# EasyEDA Pro project ProPrj_102-HQU15集成板_Vel1.0.epro, board PCB1
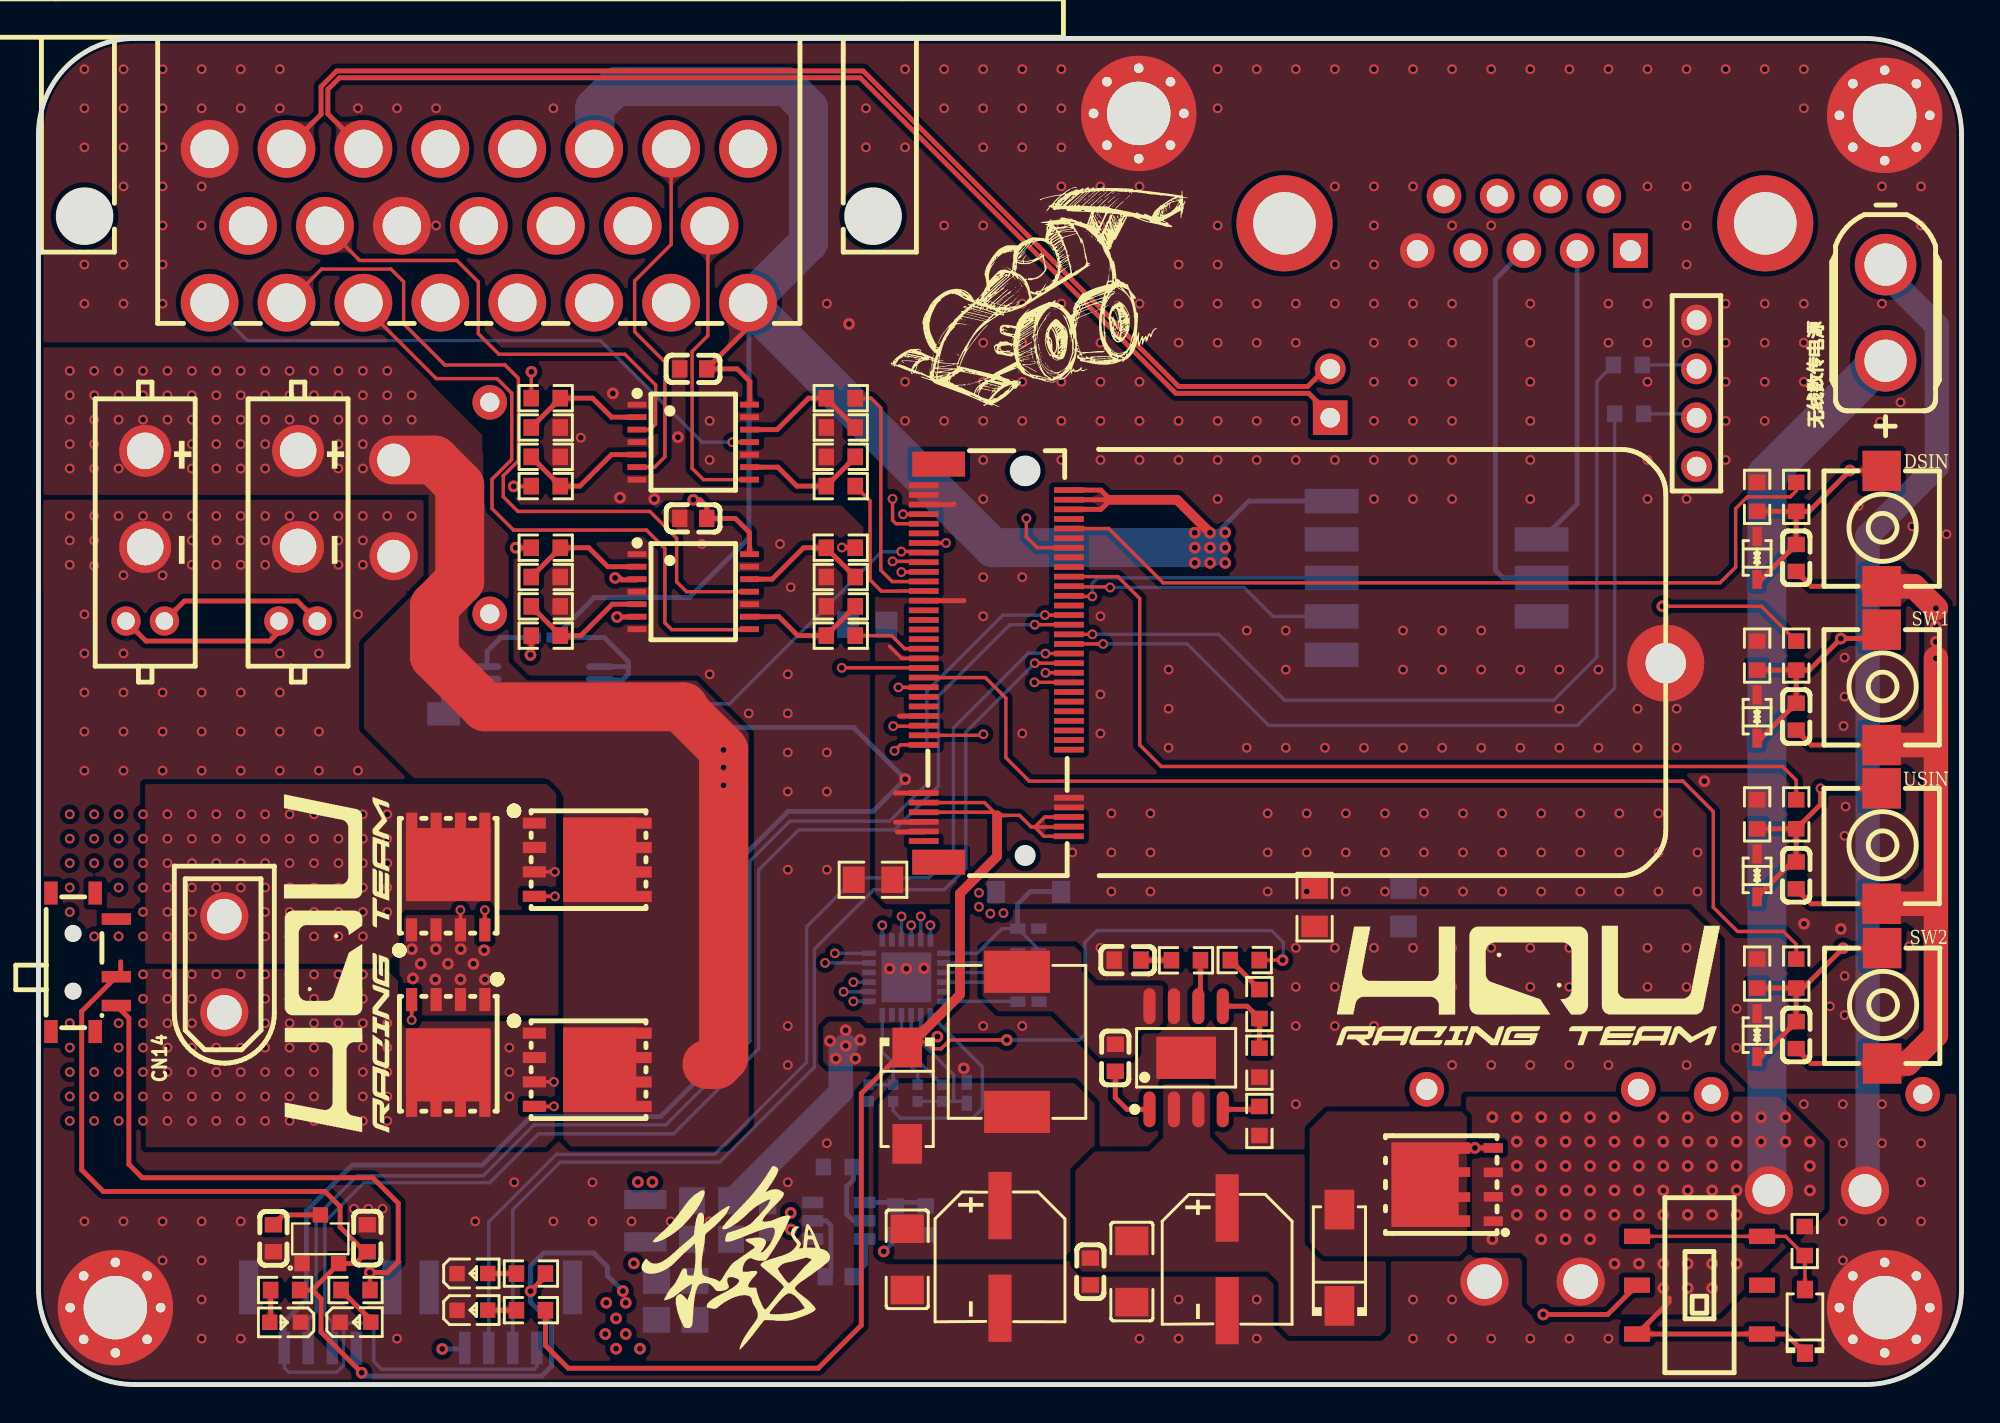
[diagram p6: board, top side]
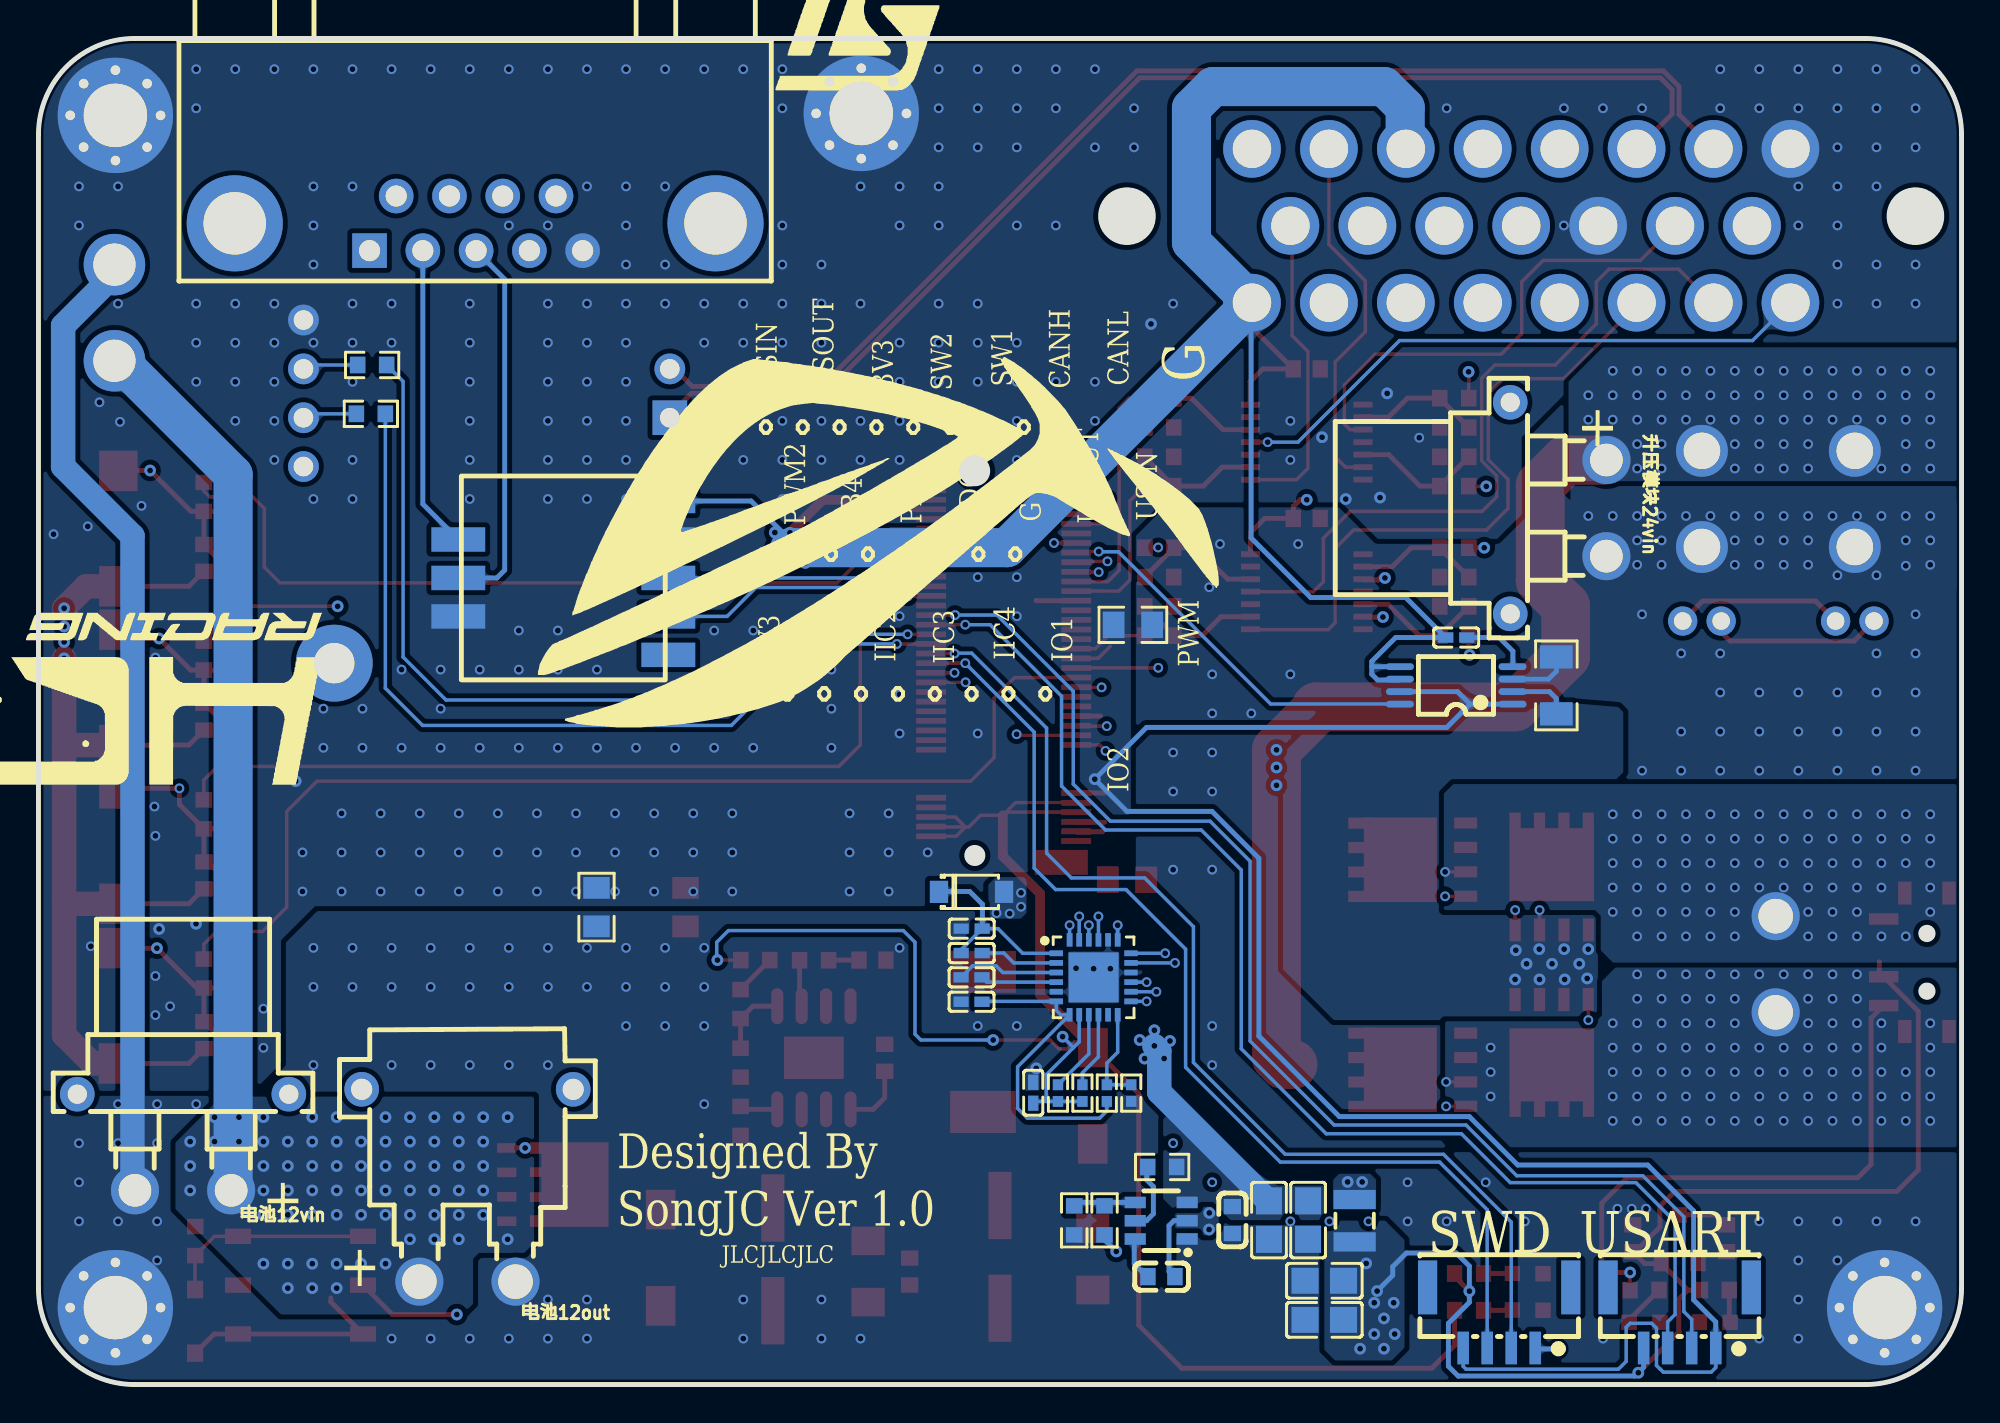
[diagram p7: board, bottom side, seen from below]

Outline 100 x 70 mm; copper layers: Top Layer, Inner1, Inner2, Bottom Layer. Coordinates in mm from the lower left corner of the outline.
Outline path: 0,65 0,5 arc(1.46,1.46) 5,0 95,0 arc(98.54,1.46) 100,5 100,65 arc(98.54,68.54) 95,70 5,70 arc(1.46,68.54) 0,65
Stack: Top Layer 0.035mm 外层铜厚1oz / Dielectric1 0.2104mm 7628 RC49% 8.6mil / Inner1 0.0152mm 内层铜厚 / Dielectric2 1.065mm 1.1mm H/HOZ Copper / Inner2 0.0152mm 内层铜厚 / Dielectric3 0.2104mm 7628 RC49% 8.6mil / Bottom Layer 0.035mm 外层铜厚1oz

## Design rules (mm)
template: 自定义配置
spacing copperThickness1oz (default): track to track 0.102, other pairs 0.152 to 0.3
spacing copperThickness2oz: track to track 0.203, other pairs 0.152 to 0.3
track width copperThickness1oz (default): min 0.127, default 0.178, max 2.54
track width copperThickness2oz: min 0.203, default 0.254, max 2.54
differential pair differentialPair (default): width min 0.127, default 0.254, max 2.54; gap min 0.152, default 0.152
via viaSize (default): diameter min 0.5, default 0.61, max 10; hole min 0.3, default 0.305, max 6.299
net VCCBAT uses ZHILIAN
net $2N1574 uses ZHILIAN
net $2N643 uses ZHILIAN
net $2N637 uses ZHILIAN
net $2N640 uses ZHILIAN
net GND_PRO uses ZHILIAN
net GND_BAT uses ZHILIAN
net VCC_+3V3 uses ZHILIAN
net VCC_+5V uses ZHILIAN
net VCC_BAT uses ZHILIAN
net VCC_+12V uses ZHILIAN
net SH2_1 uses ZHILIAN
net SH1_1 uses ZHILIAN
net SP_1 uses ZHILIAN
net VCC_+24V uses ZHILIAN

## Placement (name value [footprint] x y rotation side)
C78  100uF  [CAP-SMD_BD6.3-L6.6-W6.6-LS7.4-FD]  61.81 6.51 270 top
C79  100nF  [C0603]  54.7 5.88 90 top
C80  4.7uF  [c1206]  56.86 5.88 90 top
C81  100nF  [C0603]  56 16.99 90 top
C82  47uF  [c1206]  45.17 6.51 90 top
C83  4.7nF  [C0603]  56.63 22.07 180 top
C84  100uF  [CAP-SMD_BD6.3-L6.6-W6.6-LS7.4-FD]  50 6.64 270 top
C87  100nF  [C0603]  41.61 5.61 0 bottom
C88  22uF  [C0805]  33.13 3.36 180 bottom
C89  22uF  [C0805]  33.13 5.4 180 bottom
C90  10uF  [C0805]  33.98 8.55 270 bottom
C91  10uF  [C0805]  36.01 8.55 270 bottom
C92  100nF  [C0603]  37.92 8.55 270 bottom
C135  100nF  [C0603]  34.05 52.82 0 top
C143  1nF  [C0603]  12.22 7.61 90 top
C144  1nF  [C0603]  17.09 7.61 270 top
C150  100nF  [C0402]  51.47 23.71 180 bottom
C151  100nF  [C0402]  51.47 22.44 180 bottom
C152  100nF  [C0402]  51.48 21.18 180 bottom
C153  1uF  [C0402]  51.48 19.91 180 bottom
C154  1uF  [C0402]  48.27 15.17 270 bottom
C155  100nF  [C0402]  26.28 38.85 180 bottom
C156  100nF  [C0603]  34.05 45.04 0 top
C158  100nF  [C0603]  91.4 42.99 270 top
C160  100nF  [C0603]  91.4 26.48 270 top
C161  100nF  [C0603]  91.4 34.73 270 top
C162  100nF  [C0603]  91.4 18.17 270 top
CN1  APCI0078-P002A  [NGFF-SMD-BKEY 5+6(2235))]  49.95 37.47 90 top
CN5  776087-1  [CONN-TH_776087-1]  22.9 60.26 180 top
CN14  XT30UPB-M  [CONN-TH_XT30UPB-M]  9.67 21.86 90 top
CN16  XT30(2+2)PB-M.G.B  [CONN-TH_XT30PB-M]  13.5 44.13 270 top
CN17  XT30(2+2)PB-M.G.B  [CONN-TH_XT30PB-M]  5.55 44.13 270 top
D2  BZT52C16  [SOD-123_L2.7-W1.7-LS3.8-RD]  91.86 3.29 90 top
D24  SS54  [SMA_L4.4-W2.8-LS5.4-R-RD]  67.65 6.59 90 top
D25  SS54  [SMA_L4.4-W2.8-LS5.4-R-RD]  45.17 15.02 270 top
D31  B5819W  [SOD-123_L2.8-W1.8-LS3.7-RD]  51.48 25.62 180 bottom
D32  PESD3V3L1BA-N  [SOD-323_L1.8-W1.3-LS2.5-BI]  89.37 26.48 270 top
D33  PESD3V3L1BA-N  [SOD-323_L1.8-W1.3-LS2.5-BI]  89.37 42.99 270 top
D34  PESD3V3L1BA-N  [SOD-323_L1.8-W1.3-LS2.5-BI]  89.37 34.73 270 top
D35  PESD3V3L1BA-N  [SOD-323_L1.8-W1.3-LS2.5-BI]  89.37 18.17 270 top
H2  X6521WVS-2x04H-C60D74  [HDR-SMD_8P-P2.54-V-M-R2-C5-S7.4]  72.71 41.95 0 bottom
H3  PM254V-11-06-H85  [HDR-TH_6P-P2.54-V-F]  86.22 51.55 90 top
J1  -  [M3螺帽]  96 4 0 top
J2  -  [M3螺帽]  4 4 0 top
J3  -  [M3螺帽]  96 66 0 top
J4  -  [M3螺帽]  57.21 66.1 0 top
L4  4.7uH  [IND-SMD_L7.8-W7.0_MAPM0630F]  50.89 17.82 90 top
L5  2.2uH  [IND-SMD_L2.5-W2.0_MHCHL2520]  31.56 8.52 90 bottom
LED6  NCD0603R1  [LED0603-RD_RED]  22.56 3.87 0 top
LED7  NCD0603R1  [LED0603-RD_RED]  22.56 5.77 0 top
LED8  NCD0603R1  [LED0603-RD_RED]  12.83 3.24 180 top
LED9  NCD0603R1  [LED0603-RD_RED]  16.49 3.24 0 top
LINK1  WAFER-GH1.25-4PWB  [CONN-SMD_4P-P1.25_XUNPU_WAFER-GH1.25-4PWB]  14.66 3.48 0 bottom
Q11  TPH1R403NL  [POWERVDFN-8_L6.2-W5.2-P1.27-LS6.0-BL]  73.88 10.4 90 top
Q30  IRFH7440TRPBF  [DFN-8_L5.8-W4.9-P1.27-LS6.0-BL-1]  28.54 16.37 270 top
Q31  IRFH7440TRPBF  [DFN-8_L5.8-W4.9-P1.27-LS6.0-BL-1]  21.31 17.27 180 top
Q32  IRFH7440TRPBF  [DFN-8_L5.8-W4.9-P1.27-LS6.0-BL-1]  28.54 27.29 270 top
Q33  IRFH7440TRPBF  [DFN-8_L5.8-W4.9-P1.27-LS6.0-BL-1]  21.31 26.39 0 top
R126  200K  [R0603]  63.49 13.71 90 top
R127  51K  [R0603]  62.73 22.07 0 top
R128  1.5K  [R0603]  63.49 19.79 90 top
R129  10K  [R0603]  63.49 16.74 90 top
R130  4.7K  [R0603]  25.61 3.87 0 top
R131  20K  [R0603]  59.67 22.06 180 top
R132  10K  [R0603]  91.84 7.46 270 top
R135  4.7K  [R0603]  25.61 5.77 0 top
R136  10kΩ  [R0603]  41.57 11.31 0 bottom
R137  10kΩ  [R0603]  46.14 8.54 90 bottom
R138  33.2kΩ  [R0603]  44.56 8.54 90 bottom
R178  10kΩ  [R0603]  26.38 48.25 180 top
R179  10kΩ  [R0603]  26.38 49.77 180 top
R180  10kΩ  [R0603]  41.72 48.25 0 top
R181  10kΩ  [R0603]  41.72 49.77 0 top
R182  2.2K  [R0603]  12.83 4.91 0 top
R183  2.2K  [R0603]  16.49 4.91 0 top
R184  100R  [R0603]  26.38 43.52 180 top
R185  100R  [R0603]  26.38 38.94 180 top
R186  10kΩ  [R0402]  46.99 15.16 90 bottom
R187  10kΩ  [R0402]  45.72 15.16 90 bottom
R188  1kΩ  [R0402]  44.44 15.16 90 bottom
R189  33kΩ  [R0402]  43.18 15.16 90 bottom
R190  10kΩ  [R0603]  26.38 40.47 180 top
R191  10kΩ  [R0603]  26.38 41.99 180 top
R192  10kΩ  [R0603]  41.72 40.47 0 top
R193  10kΩ  [R0603]  41.72 41.99 0 top
R194  1kΩ  [R0603]  91.4 29.65 270 top
R195  4.7kΩ  [R0603]  89.37 29.65 270 top
R196  0Ω  [R0805]  43.09 39.51 0 bottom
R197  1kΩ  [R0603]  91.4 46.16 270 top
R198  4.7kΩ  [R0603]  89.37 46.16 270 top
R199  1kΩ  [R0603]  91.4 37.91 270 top
R200  4.7kΩ  [R0603]  89.37 37.91 270 top
R201  100R  [R0603]  26.38 51.29 180 top
R202  100R  [R0603]  26.38 46.72 0 top
R203  100R  [R0603]  41.72 51.29 0 top
R204  100R  [R0603]  41.72 46.72 0 top
R205  100R  [R0603]  41.72 43.52 0 top
R206  100R  [R0603]  41.72 38.94 0 top
R209  0Ω  [R0603]  82.65 53.02 180 bottom
R210  0Ω  [R0603]  82.72 50.48 180 bottom
R211  1kΩ  [R0603]  91.4 21.37 270 top
R212  4.7kΩ  [R0603]  89.37 21.37 270 top
R213  0Ω  [R0805]  70.98 24.83 90 bottom
R214  0Ω  [R0805]  43.4 26.25 0 top
R215  0Ω  [R0805]  66.36 24.83 90 top
SW1  SS-3235S-L3  [SW-SMD_SS-3235S-L3.00]  86.37 5.17 270 top
SW5  MSK12C02  [SW-TH_MSK12C02]  2.35 21.96 270 top
SW9  K2-1817UQ-C4SW-01  [KEY-SMD_2P-L6.0-W6.0-P6.00]  95.85 44.51 270 top
SW11  K2-1817UQ-C4SW-01  [KEY-SMD_2P-L6.0-W6.0-P6.00]  95.85 28 270 top
SW12  K2-1817UQ-C4SW-01  [KEY-SMD_2P-L6.0-W6.0-P6.00]  95.85 36.26 270 top
SW13  K2-1817UQ-C4SW-01  [KEY-SMD_2P-L6.0-W6.0-P6.00]  95.87 19.69 270 top
U27  SP1N28STER  [ESOP-8_L4.9-W3.9-P1.27-LS6.0-BL-EP3.1]  59.68 16.99 0 top
U32  TPS563201DDCR  [SOT-23-6_L2.9-W1.6-P0.95-LS2.8-BR]  41.62 8.52 180 bottom
U46  SN74HC125PWR  [TSSOP-14_L5.0-W4.4-P0.65-LS6.5-BL]  34.05 49.01 270 top
U47  LR8341A-T33  [SOT-23-3L_L2.9-W1.6-P1.90-LS2.8-BL]  14.66 7.56 0 top
U48  SN74HC125PWR  [TSSOP-14_L5.0-W4.4-P0.65-LS6.5-BL]  34.05 41.23 270 top
U49  100mΩ  [R1206]  21.07 36.36 90 bottom
U50  DRV8701ERGER  [VQFN-24_L4.0-W4.0-P0.50-BL-EP2.5]  45.13 21.18 270 bottom
U51  INA240A2PWR  [TSSOP-8_L4.4-W3.0-P0.65-LS6.4-BL]  26.28 36.36 90 bottom
U54  DR-9F  [DR9-TH_ZHOUR_DR-9P-L]  77.29 60.39 0 bottom
USART1  WAFER-GH1.25-4PWB  [CONN-SMD_4P-P1.25_XUNPU_WAFER-GH1.25-4PWB]  24.04 3.48 0 bottom
升压模块24vin  XT30PW-F20.G.Y  [CONN-TH_XT30PW-F-1]  20.97 45.58 270 bottom
无线数传电源  XT30UPB-F30.G.Y  [CONN-TH_XT30UPB-F]  96.05 55.74 90 top
电池12out  XT30PW-M30.G.Y  [CONN-TH_XT30PW-M]  77.69 10.35 0 bottom
电池12vin  XT30PW-F20.G.Y  [CONN-TH_XT30PW-F-1]  92.48 12.6 0 bottom

## Footprints (pads in the part's own frame, mm; a bottom-side part is the same pattern mirrored in y, then rotated)
C0402
  rect 0.79x0.54 smd: 1(-0.545,0) 2(0.545,0)
C0603
  rect 0.8x0.9 smd: 1(-0.7,0) 2(0.7,0)
C0805
  rect 1.41x1.35 smd: 1(-1,0) 2(1,0)
c1206
  rect 1.485x1.728 smd: 1(-1.593,0) 2(1.593,0)
CAP-SMD_BD6.3-L6.6-W6.6-LS7.4-FD
  rect 3.5x1.2 smd: 1(-2.67,0) 2(2.67,0)
CONN-SMD_4P-P1.25_XUNPU_WAFER-GH1.25-4PWB
  rect 0.6x1.7 smd: 1(-1.875,1.575) 2(-0.625,1.575) 3(0.625,1.575) 4(1.875,1.575)
  rect 1x2.8 smd: 5(3.725,-1.575) 6(-3.725,-1.575)
CONN-TH_776087-1
  round 3 hole 2: 1(-14,4) 2(-10,4) 3(-6,4) 4(-2,4) 5(2,4) 6(6,4) 7(10,4) 8(14,4) 9(-12,0) 10(-8,0) 11(-4,0) 12(0,0) 13(4,0) 14(8,0) 15(12,0) 16(-14,-4) 17(-10,-4) 18(-6,-4) 19(-2,-4) 20(2,-4) 21(6,-4) 22(10,-4) 23(14,-4)
CONN-TH_XT30PB-M
  round 1.524 hole 0.914: 1(4.425,1) 2(4.425,-1)
  round 2.7 hole 1.9: 3(0.575,0) 4(-4.425,0)
CONN-TH_XT30PW-F-1
  round 2.5 hole 1.7: 1(-2.5,2.5) 2(2.5,2.5)
  round 1.8 hole 1: 3(5.5,-2.5) 4(-5.5,-2.5)
CONN-TH_XT30PW-M
  round 2.5 hole 1.8: 1(-2.5,5) 2(2.5,5)
  round 1.8 hole 1.1: 3(5.5,-5) 4(-5.5,-5)
CONN-TH_XT30UPB-F
  round 3.2 hole 2.2: 1(-2.5,0) 2(2.5,0)
CONN-TH_XT30UPB-M
  round 2.5 hole 1.8: 1(-2.5,0) 2(2.5,0)
DFN-8_L5.8-W4.9-P1.27-LS6.0-BL-1
  rect 0.58x1.2 smd: 1(-1.907,-2.75) 2(-0.637,-2.75) 3(0.632,-2.75) 4(1.903,-2.75) 5(1.907,2.75) 6(0.637,2.75) 7(-0.632,2.75) 8(-1.903,2.75)
  rect 4.4x3.8 smd: 9(0,0.646)
DR9-TH_ZHOUR_DR-9P-L
  rect 1.8x1.8 hole 1.1: 1(5.489,1.42)
  round 1.8 hole 1.1: 2(2.719,1.42) 3(-0.051,1.42) 4(-2.821,1.42) 5(-5.59,1.42) 6(4.104,-1.42) 7(1.335,-1.42) 8(-1.435,-1.42) 9(-4.205,-1.42)
  round 5 hole 3.25: 10(-12.5,0) 11(12.5,0)
ESOP-8_L4.9-W3.9-P1.27-LS6.0-BL-EP3.1
  oval 0.63x1.865 smd: 1(-1.905,-2.683) 2(-0.635,-2.683) 3(0.635,-2.683) 4(1.905,-2.683) 5(1.905,2.683) 6(0.635,2.683) 7(-0.635,2.683) 8(-1.905,2.683)
  rect 3.1x2.2 smd: 9(0,0)
HDR-SMD_8P-P2.54-V-M-R2-C5-S7.4
  rect 2.8x1.27 smd: 1(5.461,-2) 2(5.461,0) 3(5.461,2) 4(-5.461,4) 5(-5.461,2) 6(-5.461,0) 7(-5.461,-2) 8(-5.461,-4)
HDR-TH_6P-P2.54-V-F
  rect 1.8x1.8 hole 1.02: 1(-1.27,19.05)
  round 1.6 hole 1.02: 2(1.27,19.05) 3(-3.81,0) 4(-1.27,0) 5(1.27,0) 6(3.81,0)
IND-SMD_L2.5-W2.0_MHCHL2520
  rect 1x2.2 smd: 1(-1.1,0) 2(1.1,0)
IND-SMD_L7.8-W7.0_MAPM0630F
  rect 2.194x3.42 smd: 1(3.643,0) 2(-3.643,0)
KEY-SMD_2P-L6.0-W6.0-P6.00
  rect 2.1x2 smd: 1(-3,0) 2(3,0)
LED0603-RD_RED
  rect 0.8x0.8 smd: 1(-0.799,-0.004) 2(0.799,0.004)
M3螺帽
  round 6 hole 3.302: 1(0,0)
  round 1 hole 0.5: 2(0,2.349) 3(0,-2.349) 4(2.349,0) 5(-2.349,0) 6(1.651,1.651) 7(-1.651,-1.651) 8(1.651,-1.651) 9(-1.651,1.651)
NGFF-SMD-BKEY 5+6(2235))
  rect 0.3x1.55 smd: 1(-9.212,3.914) 2(-8.962,-3.635) 3(-8.712,3.914) 4(-8.462,-3.635) 5(-8.212,3.914) 6(-7.962,-3.635) 7(-7.712,3.914) 8(-7.462,-3.635) 9(-7.212,3.914) 10(-6.962,-3.635) 11(-6.712,3.914) 20(-4.462,-3.635) 21(-4.212,3.914) 22(-3.962,-3.635) 23(-3.712,3.914) 24(-3.462,-3.635) 25(-3.212,3.914) 26(-2.962,-3.635) 27(-2.712,3.914) 28(-2.462,-3.635) 29(-2.212,3.914) 30(-1.962,-3.635) 31(-1.712,3.914) 32(-1.462,-3.635) 33(-1.212,3.914) 34(-0.962,-3.635) 35(-0.712,3.914) 36(-0.462,-3.635) 37(-0.212,3.914) 38(0.038,-3.635) 39(0.288,3.914) 40(0.538,-3.635) 41(0.788,3.914) 42(1.038,-3.635) 43(1.288,3.914) 44(1.538,-3.635) 45(1.788,3.914) 46(2.038,-3.635) 47(2.288,3.914) 48(2.538,-3.635) 49(2.788,3.914) 50(3.038,-3.635) 51(3.288,3.914) 52(3.538,-3.635) 53(3.788,3.914) 54(4.038,-3.635) 55(4.288,3.914) 56(4.538,-3.635) 57(4.788,3.914) 58(5.038,-3.635) 59(5.288,3.914) 60(5.538,-3.635) 61(5.788,3.914) 62(6.038,-3.635) 63(6.288,3.914) 64(6.538,-3.635) 65(6.788,3.914) 66(7.038,-3.635) 67(7.288,3.914) 68(7.538,-3.635) 69(7.788,3.914) 70(8.038,-3.635) 71(8.288,3.914) 72(8.538,-3.635) 73(8.788,3.914) 74(9.038,-3.635) 75(9.288,3.914)
  round 4 hole 2.1: 12(0.038,-34.671)
  rect 1.3x2.75 smd: 76(-10.312,3.139) 77(10.388,3.139)
POWERVDFN-8_L6.2-W5.2-P1.27-LS6.0-BL
  rect 0.5x1 smd: 1(-1.905,-1.775) 2(-0.635,-1.775) 3(0.635,-1.775) 4(1.905,-1.775)
  custom 4.4x4.1 smd: 5(0,1.775)
R0402
  rect 0.566x0.54 smd: 1(-0.433,0) 2(0.433,0)
R0603
  rect 0.806x0.864 smd: 1(-0.753,0) 2(0.753,0)
R0805
  rect 1.133x1.377 smd: 1(-1,0) 2(1,0)
R1206
  rect 1.208x1.701 smd: 1(-1.479,0) 2(1.479,0)
SMA_L4.4-W2.8-LS5.4-R-RD
  rect 2.062x1.539 smd: 1(2.503,0) 2(-2.503,0)
SOD-123_L2.7-W1.7-LS3.8-RD
  rect 0.91x0.84 smd: 1(-1.655,0) 2(1.655,0)
SOD-123_L2.8-W1.8-LS3.7-RD
  rect 0.95x1.15 smd: 1(-1.692,0) 2(1.692,0)
SOD-323_L1.8-W1.3-LS2.5-BI
  rect 0.985x0.49 smd: 1(-1.117,0) 2(1.117,0)
SOT-23-3L_L2.9-W1.6-P1.90-LS2.8-BL
  rect 0.8x0.8 smd: 1(-0.95,-1.265) 2(0.95,-1.265) 3(0.005,1.265)
SOT-23-6_L2.9-W1.6-P0.95-LS2.8-BR
  rect 1.1x0.6 smd: 1(1.35,-0.95) 2(1.35,0) 3(1.35,0.95) 4(-1.35,0.95) 5(-1.35,0) 6(-1.35,-0.95)
SW-SMD_SS-3235S-L3.00
  rect 0.8x1.35 smd: 1(-2.54,3.25) 2(0,3.25) 3(2.54,3.25) 4(-2.54,-3.25) 5(0,-3.25) 6(2.54,-3.25)
SW-TH_MSK12C02
  rect 0.6x1.524 smd: 1(-2.25,1.7) 2(0.75,1.7) 3(2.25,1.7)
  rect 1.2x0.7 smd: 4(-3.6,0.6) 4(-3.6,-1.7) 4(3.6,0.6) 4(3.6,-1.7)
TSSOP-8_L4.4-W3.0-P0.65-LS6.4-BL
  oval 0.353x1.454 smd: 1(-0.975,-2.927) 2(-0.325,-2.927) 3(0.325,-2.927) 4(0.975,-2.927) 5(0.975,2.927) 6(0.325,2.927) 7(-0.325,2.927) 8(-0.975,2.927)
TSSOP-14_L5.0-W4.4-P0.65-LS6.5-BL
  rect 0.305x0.991 smd: 1(-1.95,-2.925) 2(-1.3,-2.925) 3(-0.65,-2.925) 4(0,-2.925) 5(0.65,-2.925) 6(1.3,-2.925) 7(1.95,-2.925) 8(1.95,2.925) 9(1.3,2.925) 10(0.65,2.925) 11(0,2.925) 12(-0.65,2.925) 13(-1.3,2.925) 14(-1.95,2.925)
VQFN-24_L4.0-W4.0-P0.50-BL-EP2.5
  rect 0.3x0.7 smd: 1(-1.25,-1.942) 2(-0.75,-1.942) 3(-0.25,-1.942) 4(0.25,-1.942) 5(0.75,-1.942) 6(1.25,-1.942) 13(1.25,1.942) 14(0.75,1.942) 15(0.25,1.942) 16(-0.25,1.942) 17(-0.75,1.942) 18(-1.25,1.942)
  rect 0.7x0.3 smd: 7(1.948,-1.25) 8(1.948,-0.75) 9(1.948,-0.25) 10(1.948,0.25) 11(1.948,0.75) 12(1.948,1.25) 19(-1.948,1.25) 20(-1.948,0.75) 21(-1.948,0.25) 22(-1.948,-0.25) 23(-1.948,-0.75) 24(-1.948,-1.25)
  rect 2.6x2.6 smd: 25(0.001,-0.001)

## Nets
As in the schematic, except:
GND_BAT: C78.2 C79.1 C80.1 C82.1 C83.2 C84.2 C88.1 C89.1 C90.2 C91.2 C92.2 C143.1 C144.1 C150.1 C153.1 C154.1 C156.1 CN16.3 CN17.3 J1.1 J1.2 J1.3 J1.4 J1.5 J1.6 J1.7 J1.8 J1.9 J2.1 J2.2 J2.3 J2.4 J2.5 J2.6 J2.7 J2.8 J2.9 LED6.1 LED7.1 LED8.1 LED9.1 R126.1 R129.1 R132.1 R137.1 R189.1 R190.1 R191.1 R192.1 R193.1 R196.1 R213.1 R214.1 R215.1 U27.7 U27.9 U32.1 U47.1 U48.1 U48.4 U48.7 U48.10 U48.13 U49.2 U50.5 U50.16 U50.20 U50.25 U51.3 升压模块24vin.2 无线数传电源.2 电池12out.1 电池12vin.2
GND_PRO: C135.1 CN1.3 CN1.5 CN1.8 CN1.10 CN1.11 CN1.12 CN1.27 CN1.39 CN1.51 CN1.71 CN1.73 CN1.75 CN5.13 CN5.23 D32.1 D33.1 D34.1 D35.1 H2.3 H2.7 H3.6 J3.1 J3.2 J3.3 J3.4 J3.5 J3.6 J3.7 J3.8 J3.9 J4.1 J4.2 J4.3 J4.4 J4.5 J4.6 J4.7 J4.8 J4.9 LINK1.1 R178.1 R179.1 R180.1 R181.1 R195.1 R196.2 R198.1 R200.1 R212.1 R213.2 R214.2 R215.2 U46.1 U46.4 U46.7 U46.10 U46.13 U51.1 U51.7 U54.5 USART1.4
VCC_+24V: CN16.4 CN17.4 D31.2 Q30.5 Q30.6 Q30.7 Q30.8 Q30.9 Q32.5 Q32.6 Q32.7 Q32.8 Q32.9 升压模块24vin.1
VCCBAT: C143.2 U47.3

Pads without a net: CN1 1 76 77; H2 4; LINK1 5 6; SW1 2; SW5 1 4; U50 11; U54 1 4 6 7 8 9 10 11; USART1 5 6; 升压模块24vin 3 4; 电池12out 3 4; 电池12vin 3 4

## Via types
v1: diameter 0.508, hole 0.305, Top Layer to Bottom Layer, 706 vias
v2: diameter 0.61, hole 0.305, Top Layer to Bottom Layer, 149 vias

## Routing (per net, layer and track width the routed paths; a pad name or vN(x,y) marks a point on that pad's centre or on a via; arc(x,y) is an arc through that point)
AVDD_1: length 16.6
  Bottom Layer w0.178: R188.1 44.44,14.23 44.82,13.85 48.58,13.85 49.09,14.36 49.09,16.52 U50.7 46.84,19.23 47.07,19.46 U50.6 50.92,19.93 C153.2
DVDD_1: length 55.3
  Top Layer w0.254: v2(34.05,46.01) 34.4,46.01 34.75,45.67 C156.2 36.24,45.04 36.97,44.3 U48.14
  Inner1 w0.254: v2(46.75,18.09) 46.9,18.09 48.37,19.57 48.37,40.83 47.92,41.28 43.14,41.28 42.31,42.12 42.31,44.71 40.96,46.06 34.1,46.06 v2(34.05,46.01)
  Bottom Layer w0.178: R187.1 R186.1 47.59,14.72 ; 46.18,17.52 45.88,17.82 U50.8 ; 46.18,17.52 46.18,17.53 v2(46.75,18.09) ; 46.18,17.52 47.59,16.11 47.59,14.72 ; 47.59,14.72 48.18,14.72 C154.2
GND_BAT: length 54.2
  Bottom Layer w0.254: U51.3 21.48,36.68 21.07,37.09 U49.2
  Bottom Layer w1.27: 95.54,58.24 98.72,55.06 98.72,47.74 95.11,44.13 95.11,10.23 电池12vin.2
  vias: v1(1.63,45.17) v1(1.63,43.9) v1(1.63,42.63) v1(2.39,40.05) v1(2.39,38.02) v1(2.39,35.99) v1(2.39,33.96) v1(2.39,31.92) v1(2.39,8.49) v1(2.9,45.17) v1(2.9,43.9) v1(2.9,42.58) v1(4.17,45.17) v1(4.42,42.08) v1(4.42,38.02) v1(4.42,35.99) v1(4.42,33.96) v1(4.42,31.92) v1(4.42,8.49) v1(5.44,45.17) v1(6.45,42.08) v1(6.45,35.99) v1(6.45,33.96) v1(6.45,31.92) v1(6.45,8.49) v1(6.45,6.45) v1(6.71,45.17) v1(7.98,45.17) v1(7.98,43.9) v1(7.98,42.63) v1(8.49,35.99) v1(8.49,33.96) v1(8.49,31.92) v1(8.49,8.49) v1(8.49,6.45) v1(8.49,4.42) v1(8.49,2.39) v1(9.25,45.17) v1(9.25,43.9) v1(9.25,42.63) v1(10.52,45.17) v1(10.52,43.9) v1(10.52,42.63) v1(10.52,35.99) v1(10.52,33.96) v1(10.52,31.92) v1(10.52,8.49) v1(10.52,2.39) v1(11.79,45.17) v1(11.79,43.9) v1(11.79,42.63) v1(12.55,38.02) v1(12.55,35.99) v1(12.55,33.96) v1(12.55,31.92) v1(13.06,45.17) v1(14.33,45.17) v1(14.58,38.02) v1(14.58,33.96) v1(14.58,31.92) v1(15.6,45.17) v1(15.6,43.9) v1(15.6,42.63) v1(16.41,9.14) v1(16.61,40.05) v1(16.61,31.92) v1(16.87,45.17) v1(16.87,43.9) v1(16.87,42.63) v1(17.15,9.14) v1(17.89,9.14) v1(18.14,45.17) v1(18.65,2.39) v1(19.41,45.17) v1(22.71,8.49) v1(24.74,10.52) v1(26.77,8.49) v1(28.81,10.52) v1(28.81,8.49) v1(30.84,8.49) v1(32.87,8.49) v1(34.5,43.71) v1(34.9,36.93) v1(34.9,8.49) v1(36.93,34.9) v1(38.56,43.71) v1(38.97,36.93) v1(38.97,34.9) v1(38.97,32.87) v1(38.97,30.84) v1(38.97,26.77) v1(38.97,18.65) v1(38.97,16.61) v1(38.97,10.52) v1(39.12,41.46) v1(41,32.87) v1(41,30.84) v1(41,26.77) v1(41,12.55) v1(49.13,18.65) v1(51.16,18.65) v1(55.22,22.71) v1(57.25,2.39) v1(59.29,4.42) v1(59.29,2.39) v1(63.35,4.42) v1(63.35,2.39) v1(65.38,22.71) v1(65.38,20.68) v1(65.38,18.65) v1(65.38,14.58) v1(67.41,22.71) v1(67.41,20.68) v1(67.41,18.65) v1(69.45,22.71) v1(69.45,20.68) v1(69.45,18.65) v1(71.48,22.71) v1(71.48,20.68) v1(71.48,4.42) v1(71.48,2.39) v1(73.51,22.71) v1(73.51,20.68) v1(73.51,16.61) v1(73.51,4.42) v1(73.51,2.39) v1(75.54,22.71) v1(75.54,20.68) v1(75.54,16.61) v1(75.54,2.39) v1(77.57,22.71) v1(77.57,20.68) v1(77.57,16.61) v1(77.57,2.39) v1(79.61,22.71) v1(79.61,20.68) v1(79.61,16.61) v1(79.61,2.39) v1(81.64,22.71) v1(81.64,20.68) v1(81.64,16.61) v1(81.64,2.39) v1(83.67,22.71) v1(83.67,20.68) v1(85.7,22.71) v1(85.7,20.68) v1(85.7,16.61) v1(91.8,14.58) v1(93.83,14.58) v1(93.83,12.55) v1(93.83,8.49) v1(93.83,6.45) v1(95.86,14.58) v1(95.86,12.55) v1(95.86,8.49) v1(97.89,12.55) v1(97.89,10.52) v1(97.89,8.49) v2(44.26,21.62) v2(45.13,21.62) v2(46.05,21.65) v2(48.12,16.44)
GND_PRO: length 111.5
  Top Layer w0.178: 44.26,38.39 44.88,37.77 44.97,37.77 44.98,37.76 46.03,37.76
  Top Layer w0.254: 46.03,34.76 44.77,34.76 ; 44.56,30.77 44.57,30.76 46.03,30.76 ; 47.61,45.81 47.57,45.76 46.03,45.76 ; 46.03,40.76 48.11,40.76 48.12,40.78 ; 46.03,29.26 46.02,29.25 44.56,29.25 ; 44.67,28.74 46.01,28.74 46.03,28.76
  Bottom Layer w0.178: USART1.4 25.92,0.94 25.77,0.8 17.84,0.8 17.44,1.2 17.44,2.98 17.23,3.19 16.12,3.19 15.86,2.93 15.86,0.99 15.68,0.81 15.67,0.81 15.51,0.65 13.02,0.65 12.78,0.88 LINK1.1
  Bottom Layer w0.254: 25.56,35.38 26.21,36.03 U51.7 ; 25.56,35.38 26.76,34.17 42.38,34.17 v2(45.07,31.48) 43.4,29.8 38.98,29.8 36.54,27.37 36.54,18.12 32.35,13.93 25.59,13.93 23.08,11.41 16.32,11.41 13.93,9.03 13.93,4.4 12.78,3.25 LINK1.1 ; 25.56,35.38 U51.1
  vias: v1(2.39,68.4) v1(2.39,66.37) v1(2.39,64.34) v1(2.39,58.24) v1(2.39,56.21) v1(4.42,68.4) v1(4.42,66.37) v1(4.42,64.34) v1(4.42,62.31) v1(4.42,58.24) v1(4.42,56.21) v1(6.45,68.4) v1(6.45,66.37) v1(6.45,64.34) v1(6.45,62.31) v1(6.45,60.27) v1(6.45,58.24) v1(6.45,56.21) v1(8.49,68.4) v1(8.49,66.37) v1(8.49,62.31) v1(8.49,60.27) v1(10.52,68.4) v1(10.52,66.37) v1(12.55,68.4) v1(12.55,66.37) v1(16.61,66.37) v1(18.65,66.37) v1(20.68,66.37) v1(20.68,60.27) v1(26.77,66.37) v1(28.2,49.24) v1(34.9,50.11) v1(34.9,48.08) v1(41,56.21) v1(43.03,66.37) v1(43.03,64.34) v1(45.06,68.4) v1(45.06,64.34) v1(45.06,52.15) v1(45.06,50.11) v1(47.09,68.4) v1(47.09,66.37) v1(47.09,60.27) v1(47.09,52.15) v1(47.09,50.11) v1(49.13,68.4) v1(49.13,66.37) v1(49.13,64.34) v1(49.13,60.27) v1(49.13,54.18) v1(49.13,52.15) v1(49.13,50.11) v1(49.13,48.08) v1(49.13,46.05) v1(49.13,41.99) v1(49.13,39.95) v1(51.16,68.4) v1(51.16,66.37) v1(51.16,64.34) v1(51.16,56.21) v1(51.16,54.18) v1(51.16,52.15) v1(51.16,50.11) v1(51.16,41.99) v1(51.16,33.86) v1(53.19,68.4) v1(53.19,66.37) v1(53.19,64.34) v1(53.19,62.31) v1(53.19,60.27) v1(53.19,56.21) v1(53.19,54.18) v1(53.19,52.15) v1(53.19,50.11) v1(53.19,48.08) v1(53.76,27.67) v1(55.22,62.31) v1(55.22,60.27) v1(55.22,54.18) v1(55.22,52.15) v1(55.22,50.11) v1(55.22,48.08) v1(55.22,39.95) v1(55.22,35.89) v1(55.22,33.86) v1(55.79,29.7) v1(55.79,27.67) v1(55.79,25.64) v1(57.25,62.31) v1(57.25,56.21) v1(57.25,52.15) v1(57.25,50.11) v1(57.25,48.08) v1(57.82,29.7) v1(57.82,27.67) v1(57.82,25.64) v1(58.77,37.18) v1(58.77,35.15) v1(58.77,33.11) v1(59.29,58.24) v1(59.29,56.21) v1(59.29,54.18) v1(59.29,50.11) v1(59.29,48.08) v1(61.32,68.4) v1(61.32,66.37) v1(61.32,60.27) v1(61.32,58.24) v1(61.32,56.21) v1(61.32,54.18) v1(61.32,50.11) v1(61.32,48.08) v1(61.32,46.05) v1(62.83,39.21) v1(62.83,33.11) v1(63.35,68.4) v1(63.35,56.21) v1(63.35,54.18) v1(63.35,50.11) v1(63.35,48.08) v1(63.92,29.7) v1(63.92,27.67) v1(63.92,25.64) v1(64.86,39.21) v1(64.86,37.18) v1(64.86,33.11) v1(65.38,68.4) v1(65.38,56.21) v1(65.38,54.18) v1(65.38,50.11) v1(65.38,48.08) v1(65.95,29.7) v1(65.95,27.67) v1(65.95,25.64) v1(66.9,33.11) v1(67.41,68.4) v1(67.41,62.31) v1(67.41,58.24) v1(67.41,56.21) v1(67.41,48.08) v1(67.98,29.7) v1(67.98,27.67) v1(67.98,25.64) v1(68.93,33.11) v1(69.45,68.4) v1(69.45,62.31) v1(69.45,60.27) v1(69.45,58.24) v1(69.45,56.21) v1(69.45,54.18) v1(69.45,52.15) v1(69.45,50.11) v1(69.45,48.08) v1(69.45,46.05) v1(70.01,29.7) v1(70.01,27.67) v1(70.01,25.64) v1(70.96,39.21) v1(70.96,37.18) v1(70.96,33.11) v1(71.48,68.4) v1(71.48,62.31) v1(71.48,56.21) v1(71.48,54.18) v1(71.48,52.15) v1(71.48,50.11) v1(71.48,48.08) v1(71.48,46.05) v1(72.05,29.7) v1(72.05,27.67) v1(72.05,25.64) v1(72.99,39.21) v1(72.99,37.18) v1(72.99,33.11) v1(73.51,68.4) v1(73.51,60.27) v1(73.51,56.21) v1(73.51,54.18) v1(73.51,52.15) v1(73.51,50.11) v1(73.51,48.08) v1(73.51,46.05) v1(74.08,29.7) v1(74.08,27.67) v1(74.08,25.64) v1(75.02,39.21) v1(75.02,37.18) v1(75.02,33.11) v1(75.54,68.4) v1(75.54,60.27) v1(76.11,29.7) v1(76.11,27.67) v1(76.11,25.64) v1(77.06,37.18) v1(77.06,33.11) v1(77.57,68.4) v1(77.57,56.21) v1(77.57,54.18) v1(77.57,52.15) v1(77.57,50.11) v1(77.57,48.08) v1(77.57,46.05) v1(78.14,29.7) v1(78.14,27.67) v1(78.14,25.64) v1(79.09,37.18) v1(79.09,35.15) v1(79.09,33.11) v1(79.61,68.4) v1(80.18,29.7) v1(80.18,27.67) v1(80.18,25.64) v1(81.12,37.18) v1(81.12,33.11) v1(81.64,68.4) v1(81.64,56.21) v1(81.64,54.18) v1(82.21,29.7) v1(82.21,27.67) v1(82.21,25.64) v1(83.15,35.15) v1(83.15,33.11) v1(83.67,68.4) v1(83.67,62.31) v1(83.67,56.21) v1(83.67,54.18) v1(83.67,52.15) v1(83.67,48.08) v1(83.67,46.05) v1(84.24,29.7) v1(84.24,27.67) v1(84.24,25.64) v1(85.18,35.15) v1(85.18,33.11) v1(85.7,68.4) v1(85.7,62.31) v1(85.7,60.27) v1(85.7,58.24) v1(85.7,54.18) v1(85.7,46.05) v1(86.27,27.67) v1(86.27,25.64) v1(87.73,68.4) v1(87.73,56.21) v1(87.73,54.18) v1(87.73,52.15) v1(87.73,50.11) v1(87.73,48.08) v1(88.3,19.54) v1(88.3,17.51) v1(89.77,68.4) v1(89.77,56.21) v1(89.77,54.18) v1(89.77,52.15) v1(89.77,50.11) v1(91.8,68.4) v1(91.8,66.37) v1(91.8,56.21) v1(91.8,54.18) v1(91.8,52.15) v1(93.16,19.67) v1(93.92,37.81) v1(93.92,35.77) v1(93.87,34.25) v1(93.92,28.53) v1(93.92,21.24) v1(93.92,19.21) v1(93.97,30.06) v1(94.64,45.69) v1(95.76,50.06) v1(95.86,62.31) v1(95.86,56.21) v1(96.83,51.08) v1(97.28,22.79) v1(97.44,44.63) v1(97.89,62.31) v1(97.89,60.27) v1(99.22,44.22) v2(29.87,51.54) v2(30.24,46.12) v2(32.02,46.05) v2(33.25,49.26) v2(42.15,55.15) v2(86.63,31.38) v2(91.81,23.96) v2(93.73,23.69)
VCC_+3V3: length 354.2
  Top Layer w0.254: 91.4,42.29 92.18,41.51 SW9.2 ; SW12.2 92.18,33.26 C161.2 ; 53.58,46.51 55.24,46.51 55.74,46.01 ; v2(25.59,4.86) 26.36,5.63 R135.2 ; SW13.2 92.18,16.69 C162.2 ; v2(16.81,0.61) 14.69,2.73 14.69,4.46 14.24,4.91 ; 14.24,4.91 15.61,6.28 U47.2 16.48,6.29 C144.2 16.97,6.91 15.69,8.19 15.69,9.25 14.9,10.04 3.37,10.04 2.25,11.16 2.25,19.41 4.28,21.43 4.28,21.98 ; 14.24,4.91 R182.2 ; 53.58,45.51 55.24,45.51 55.74,46.01 55.74,46.01 ; SW11.2 92.18,25 C160.2 ; CN5.1 36.9,54.97 C135.2 36.34,52.82 37,52.16 37,50.98 36.97,50.96 ; 55.74,46.01 53.58,46.01
  Top Layer w0.508: 55.74,46.01 59.21,46.01 v2(60.92,44.3)
  Top Layer w1.27: SW13.2 97.19,16.69 98.67,18.17 98.67,25.01 ; 98.67,33.3 98.62,33.26 SW12.2 ; 98.67,33.3 v2(98.67,37.76) ; 98.67,33.3 98.67,25.01 ; 98.67,25.01 98.66,25 SW11.2 ; v2(98.67,40.37) 97.53,41.51 SW9.2
  Inner1 w0.254: v2(43.96,6.92) 43.33,6.3 v2(30.96,6.3)
  Inner2 w1.27: v2(60.92,43.52) 96.94,43.52 98.67,41.79 v2(98.67,40.37) v2(98.67,39.42) v2(98.67,38.62) v2(98.67,37.76)
  Inner2 w2.54: v2(60.92,43.52) 60.92,8.82 55.74,3.64 31.55,3.64 v2(30.54,2.63)
  Bottom Layer w0.254: 36.94,56.21 36.94,44.03 33.85,40.93 28.9,40.93 C155.1 29.43,38.85 30.67,37.6 30.67,37.33 ; R138.1 44.56,7.53 v2(43.96,6.92) ; LINK1.4 16.53,0.89 16.98,0.44 26.17,0.44 26.68,0.95 26.68,3.19 25.59,4.28 v2(25.59,4.86) 25.59,6.16 26.28,6.84 28.87,6.84 29.58,6.13 29.58,5.67 v2(30.39,4.86) ; U51.6 29.25,36.64 30.36,36.64 30.67,36.94 30.67,37.33 ; 60.92,43.93 62.94,45.95 H2.8 ; U51.5 30.67,37.33
  Bottom Layer w2.032: v2(60.92,43.52) v2(60.13,43.52) 49.64,43.52 36.94,56.21 CN5.1 40.04,59.4 40.04,66.38 38.93,67.5 30.02,67.5 28.93,66.41 28.93,64.29 CN5.18
  vias: v2(29.53,4.25) v2(29.48,2.63) v2(30.04,3.44) v2(30.04,1.86) v2(30.54,4.25) v2(31.28,1.86) v2(60.12,44.3) v2(60.13,42.73) v2(60.93,42.73) v2(61.71,44.31) v2(61.71,43.52) v2(61.71,42.73)
VCC_+5V: length 211.5
  Top Layer w0.178: 51.8,28.99 52.32,29.51 53.58,29.51 ; 51.8,28.99 53.56,28.99 53.58,29.01 ; 51.8,28.99 51.63,28.99 51.02,29.6 49.85,29.6 49.69,29.76 ; 51.8,28.99 52.28,28.51 53.58,28.51 ; v2(50.36,17.92) 47.4,17.92 46.94,17.46 46.49,17.46 46.13,17.82 45.46,17.82 ; 46.03,29.76 49.69,29.76 ; 49.69,29.76 49.19,30.26 46.03,30.26 ; R127.2 v2(64.69,22.07)
  Top Layer w0.254: R130.2 26.36,2.03 27.55,0.85 40.55,0.85 42.79,3.08 42.79,15.14 45.17,17.53
  Top Layer w0.508: 49.85,29.6 49.85,27.47 47.92,25.54 47.92,20.27 45.46,17.82 45.17,17.53
  Inner1 w0.254: v2(21,1.85) 21,9.08 23.18,11.26 38.16,11.26 41.97,15.07 v2(41.97,17.61)
  Inner1 w0.508: H3.3 87.69,46.26 87.69,20.25 85.81,18.37 72.05,18.37 70.83,17.16 42.69,17.16 v2(42.48,16.95)
  Bottom Layer w0.178: v2(50.36,17.92) 54.12,17.92 54.42,18.22 54.42,23 55.03,23.61 64.12,23.61 64.73,23 64.73,22.03
  Bottom Layer w0.254: v2(21,1.85) 22.11,1.85 USART1.1
  Bottom Layer w1.27: 36.11,9.6 41.72,15.21 41.72,17.36 v2(41.97,17.61)
  vias: v2(41.16,17.87) v2(41.47,16.95) v2(41.97,18.42) v2(42.74,17.92)
VCC_+12V: length 57.3
  Top Layer w0.254: D2.1 90.86,2.63 SW1.6 84.8,4.3 84.8,4.51
  Bottom Layer w2.032: 95.54,53.24 95.54,52.98 89.88,47.32 89.88,10.15 89.93,10.1 电池12vin.1
  vias: v2(75.6,13.9) v2(75.6,7.55) v2(76.87,13.9) v2(76.87,12.63) v2(76.87,11.36) v2(76.87,10.09) v2(76.87,8.82) v2(78.14,13.9) v2(78.14,12.63) v2(78.14,11.36) v2(78.14,10.09) v2(78.14,8.82) v2(78.14,7.55) v2(79.41,13.9) v2(79.41,12.63) v2(79.41,11.36) v2(79.41,10.09) v2(79.41,8.82) v2(79.41,7.55) v2(80.68,13.9) v2(80.68,12.63) v2(80.68,11.36) v2(80.68,10.09) v2(80.68,8.82) v2(80.68,7.55) v2(81.95,13.9) v2(81.95,12.63) v2(81.95,11.36) v2(81.95,10.09) v2(81.95,8.82) v2(81.95,6.28) v2(83.22,12.63) v2(83.22,11.36) v2(83.22,10.09) v2(83.22,8.82) v2(83.22,6.28) v2(84.49,13.9) v2(84.49,12.63) v2(84.49,11.36) v2(84.49,10.09) v2(84.49,8.82) v2(84.49,6.28) v2(84.49,5.01) v2(85.76,13.9) v2(85.76,12.63) v2(85.76,11.36) v2(85.76,10.09) v2(85.76,8.82) v2(85.76,6.28) v2(85.76,5.01) v2(87.03,12.63) v2(87.03,11.36) v2(87.03,10.09) v2(87.03,8.82) v2(87.03,6.28) v2(87.03,5.01) v2(88.3,13.9) v2(88.3,12.63) v2(88.3,11.36) v2(88.3,10.09) v2(88.3,8.82) v2(88.3,6.28) v2(89.57,13.9) v2(89.57,12.63) v2(90.84,13.9) v2(90.84,12.63) v2(92.11,12.63) v2(92.11,11.36) v2(92.11,10.09)
VCC_+24V: length 67.8
  Top Layer w2.54: 34.76,16.65 35.27,16.65 35.62,17 v2(35.62,31.16) v2(35.62,32.09) v2(35.62,33) 33.54,35.09 33.54,35.24 23.23,35.24 20.59,37.88 20.59,40.48 21.91,41.8 21.91,46.76 20.59,48.08 升压模块24vin.1
  Inner2 w1.27: v1(48.91,25.57) 36.4,25.57 35.62,26.35 v2(35.62,31.16) v2(35.62,32.09) v2(35.62,33)
  vias: v1(1.63,52.72) v1(1.63,51.44) v1(1.63,50.17) v1(1.63,48.91) v1(1.63,47.64) v1(2.9,52.72) v1(2.9,51.44) v1(2.9,50.17) v1(2.9,48.91) v1(2.9,47.64) v1(4.17,52.72) v1(4.17,51.44) v1(4.17,50.17) v1(4.17,47.64) v1(5.44,52.72) v1(5.44,51.44) v1(5.44,50.17) v1(6.71,52.72) v1(6.71,51.44) v1(6.71,50.17) v1(7.98,52.72) v1(7.98,51.44) v1(7.98,50.17) v1(7.98,48.91) v1(7.98,47.64) v1(9.25,52.72) v1(9.25,51.44) v1(9.25,50.17) v1(9.25,48.91) v1(9.25,47.64) v1(10.52,52.72) v1(10.52,51.44) v1(10.52,50.17) v1(10.52,48.91) v1(10.52,47.64) v1(11.79,52.72) v1(11.79,51.44) v1(11.79,50.17) v1(11.79,48.91) v1(11.79,47.64) v1(13.06,52.72) v1(13.06,51.44) v1(13.06,50.17) v1(14.33,52.72) v1(14.33,51.44) v1(14.33,50.17) v1(15.6,52.72) v1(15.6,51.44) v1(15.6,50.17) v1(15.6,48.91) v1(15.6,47.64) v1(16.87,52.72) v1(16.87,51.44) v1(16.87,50.17) v1(16.87,48.91) v1(16.87,47.64) v1(18.14,52.72) v1(18.14,51.44) v1(18.14,50.17) v1(19.41,51.44) v1(19.41,50.17) v1(48.91,24.85) v1(49.5,24.49) v1(50.18,24.52)
VCCBAT: length 2.7
  Top Layer w0.254: C143.2 12.73,8.82 U47.3
232_RX: length 14.5
  Top Layer w0.178: 53.58,41.01 53.61,40.98 v1(54.8,40.98)
  Bottom Layer w0.178: H2.6 55.08,41.95 54.8,41.67 v1(54.8,40.98)
232_TX: length 14.3
  Top Layer w0.178: 53.58,41.51 53.62,41.48 55.7,41.48 v1(55.73,41.45)
  Bottom Layer w0.178: H2.5 64.19,39.95 62.69,41.45 v1(55.73,41.45)
232R: length 19.8
  Bottom Layer w0.254: H2.2 76.16,41.95 75.76,42.35 75.76,57.48 U54.3
232T: length 15.8
  Bottom Layer w0.254: U54.2 80.01,45.79 H2.1
ADC1_IN10: length 47.5
  Top Layer w0.178: v2(84.44,40.47) 89.59,40.47 R199.1 ; v1(47.19,43.76) 46.03,43.76
  Inner1 w0.178: v2(84.44,40.47) 58.08,40.47 54.79,43.76 v1(47.19,43.76)
ADC1_IN11: length 20.3
  Top Layer w0.178: v1(44.87,43.32) 45.98,43.32 46.03,43.26
  Bottom Layer w0.178: v1(44.87,43.32) 44.86,43.3 43.84,43.3 35.93,35.39 29.06,35.39
ADC1_IN12: length 35.9
  Top Layer w0.178: v1(44.41,42.81) 45.99,42.81 46.03,42.76
  Inner1 w0.178: v1(44.41,42.81) 43.8,42.81 43.4,43.22 43.4,52.61 38.01,58 37.62,58 37.62,58 25.62,58 23.36,60.26 CN5.12
CAN_RX: length 45.2
  Top Layer w0.178: v1(55.36,38.51) 53.58,38.51
  Bottom Layer w0.178: R210.2 81.96,36.21 80.02,34.28 63.97,34.28 59.73,38.51 v1(55.36,38.51)
CAN_TX: length 45.3
  Top Layer w0.178: v1(54.8,39.01) 53.58,39.01
  Bottom Layer w0.178: v1(54.8,39.01) 61.37,39.01 64.78,35.6 78.8,35.6 81.04,37.83 81.04,52.17 R209.2
CANH: length 113
  Top Layer w0.254: CN16.2 12.5,39.14 12.02,38.66 5.59,38.66 CN17.2 ; 67.12,50.48 66.05,51.55 59.14,51.55 42.74,67.95 15.65,67.95 15.05,67.35 15.05,66.08 16.87,64.26 CN5.21
  Inner2 w0.254: CN16.2 13.32,38.88 13.32,37.58 14.55,36.36 17.03,36.36 21.15,40.47 21.15,52.56 19.12,54.58 19.12,57.52 17.12,59.52 17.12,61.06 15.1,63.08 15.1,64.04 15.32,64.26 CN5.21
CANL: length 112.1
  Top Layer w0.254: 67.12,53.02 66,51.9 59.29,51.9 42.88,68.31 15.51,68.31 14.69,67.5 14.69,66.06 CN5.22 ; CN16.1 13.46,40.75 7.59,40.75 CN17.1
  Inner2 w0.254: CN5.22 14.53,64.26 14.75,64.04 14.75,62.93 16.68,61 16.68,59.46 18.76,57.37 18.76,54.44 20.79,52.41 20.79,40.62 16.88,36.71 14.69,36.71 13.68,37.73 13.68,38.88 CN16.1
DOWNSHIFTSIGN_OUT: length 19.1
  Top Layer w0.178: CN5.17 32.9,59.29 31,57.39 31,54.75 32.58,53.17 32.58,48.25 32.04,47.71 U46.6
DOWNSIGN_IN: length 92.7
  Top Layer w0.254: D33.2 89.58,41.87 C158.1 R197.2 ; R197.2 92.07,45.41 v2(94.2,47.53) 95.82,47.53 SW9.1 ; R197.2 R198.2
  Inner1 w0.178: v2(94.2,47.53) 94.15,47.58 94.15,62.88 90.08,66.94 64.02,66.94 55.74,58.66 41.11,58.66 36.9,62.87 CN5.16
EN-IN_1: length 6.8
  Top Layer w0.254: U48.5 29.84,40.58 28.2,38.94 R185.1 27.13,38.96 R190.2
EN_1: length 41.1
  Top Layer w0.254: U48.6 31.11,39.91 v2(30.09,39.91)
  Inner1 w0.178: v2(30.09,39.91) 30.26,39.74 39.76,39.74 40.65,38.85 40.65,36.71 43.24,34.12 43.24,26.76 43.7,26.3 46.04,26.3 47.51,24.83 47.51,21.37 46.56,20.42 41.87,20.42 v1(41.87,20.43)
  Bottom Layer w0.178: v1(41.87,20.43) U50.14
ENCODER1: length 41.7
  Top Layer w0.178: 46.03,33.26 44.82,33.26 v1(44.51,32.95)
  Inner2 w0.178: CN5.2 35.12,54.04 47.41,54.04 48.27,53.17 48.27,33.87 47.36,32.95 v1(44.51,32.95)
ENCODER2: length 43.3
  Top Layer w0.178: v1(44.45,34.24) 46.01,34.24 46.03,34.26
  Inner2 w0.178: CN5.3 31.73,53.43 46.85,53.43 47.76,52.51 47.76,34.78 47.22,34.24 v1(44.45,34.24)
ENCODER3: length 29.9
  Top Layer w0.178: v1(44.41,46.06) 44.41,44.94 44.59,44.76 46.03,44.76
  Inner2 w0.178: v1(44.41,46.06) 44.41,51.85 43.5,52.77 28.39,52.77 CN5.4
ENCODER4: length 32.8
  Top Layer w0.178: 46.03,45.26 46.03,45.26 v1(44.96,45.26)
  Inner2 w0.178: v1(44.96,45.26) 44.2,45.26 43.75,45.7 43.75,51.09 42.74,52.11 25.05,52.11 CN5.5
ENIN_1: length 52
  Top Layer w0.178: v1(51.79,36.52) 53.58,36.52 53.58,36.51
  Top Layer w0.254: v2(25.58,37.94) 25.62,37.98 R185.2
  Inner2 w0.178: v1(51.79,36.52) 50.36,35.08 50.36,33.06 49.33,32.03 43.75,32.03 43.29,32.49 43.29,44.64 41.26,46.67 28.92,46.67 25.62,43.37 25.62,37.97 v2(25.58,37.94)
GH1_1: length 20.2
  Top Layer w0.178: v1(26.85,25.39) Q32.4
  Inner1 w0.178: v1(40.9,21.93) 27.96,21.93 26.85,23.03 v1(26.85,25.39)
  Bottom Layer w0.178: v1(40.9,21.93) U50.17
GH2_1: length 28.3
  Top Layer w0.178: v1(26.8,14.47) Q30.4
  Inner1 w0.178: v1(26.8,14.47) 27.5,15.16 27.5,19.64 28.56,20.71 41.36,20.71 42.99,22.34 45.58,22.34 46.38,23.14 v1(46.38,23.89)
  Bottom Layer w0.178: v1(46.38,23.89) U50.24
GL1_1: length 27.9
  Top Layer w0.178: v1(23.21,24.67) Q33.4
  Inner1 w0.178: 43.88,23.89 43.09,23.1 28.97,23.1 28.41,23.66 28.41,26.35 27.34,27.42 24.91,27.42 23.21,25.72 v1(23.21,24.67)
  Bottom Layer w0.178: v1(43.88,23.89) U50.19
GL2_1: length 39.6
  Top Layer w0.178: v1(19.41,18.95) Q31.4
  Inner1 w0.178: v1(45.38,23.89) 45.38,24.54 45.02,24.9 43.42,24.9 42.74,24.22 30.26,24.22 29.63,24.85 29.63,26.96 28.1,28.48 24.04,28.48 18.5,22.95 18.5,19.59 19.15,18.95 19.4,18.95
  Bottom Layer w0.178: v1(45.38,23.89) U50.22
IOOUT1: length 34.5
  Top Layer w0.178: U48.8 36.95,39.25 32.93,39.25 32.58,39.61 32.58,43.48 31.62,44.44 24.7,44.44 23.58,45.55 23.58,47.08 24.61,48.1 24.61,51.55 23.85,52.31 20.69,52.31 16.9,56.1 CN5.6
IOOUT1_IN: length 3.8
  Top Layer w0.178: 46.03,38.26 45.05,38.26 44.37,38.94 R206.2
IOOUT2: length 39.1
  Top Layer w0.178: CN5.7 12.97,56.26 14.72,58.01 18.33,58.01 18.99,57.34 18.99,55.16 21.13,53.02 24.26,53.02 24.96,52.33 24.96,48.04 24.17,47.25 24.17,46.17 24.93,45.41 31.79,45.41 33.19,44.01 33.19,41.74 33.7,41.23 U48.11
IOOUT2_IN: length 11.2
  Top Layer w0.178: 46.03,37.26 46.03,37.27 v1(41.77,37.27)
  Top Layer w0.254: v1(41.78,43.53) 42.46,43.53 R205.2
  Inner2 w0.178: v1(41.78,43.53) 41.78,37.28 v1(41.77,37.27)
LINK1: length 67.4
  Top Layer w0.178: v1(52.34,40.02) 53.58,40.02
  Bottom Layer w0.178: v1(52.34,40.02) 50.15,40.02 46.19,36.05 46.19,31.23 44.26,29.3 39.08,29.3 37,27.21 37,17.87 32.63,13.5 25.77,13.5 23.13,10.86 16.57,10.86 14.44,8.72 14.44,3.79 14.03,3.39 LINK1.2
LINK2: length 66.5
  Top Layer w0.178: v1(51.81,39.51) 53.58,39.51
  Bottom Layer w0.178: v1(51.81,39.51) 50.51,39.51 46.8,35.8 46.8,31.12 44.51,28.84 39.53,28.84 37.45,26.76 37.45,17.46 33.03,13.04 26.01,13.04 23.47,10.5 16.93,10.5 14.9,8.47 14.9,3.64 15.28,3.26 LINK1.3
MCU_DOWMSHIFTSIGN_OUT: length 30.8
  Top Layer w0.178: v1(44.72,36.26) 46.03,36.26 46.03,36.26 ; R202.1 25.61,46.71 v2(24.71,46.71)
  Inner1 w0.178: v2(24.71,46.71) 26.48,44.94 40.5,44.94 41.28,44.17 41.28,36.9 41.92,36.26 v1(44.72,36.26)
MCU_DOWNSIGN_IN: length 43.2
  Top Layer w0.178: R197.1 91.4,46.47 91.1,46.16 88.86,46.16 88.25,45.55 88.25,42.5 87.44,41.69 58.48,41.69 55.66,44.51 53.58,44.51
MCU_SERVOPWM_1: length 12.5
  Top Layer w0.178: R203.2 43.29,51.29 43.8,50.78 43.8,42.35 44.4,41.75 46.03,41.75 46.03,41.76
MCU_SERVOPWM_2: length 8.2
  Top Layer w0.178: R204.2 43.24,45.95 43.24,41.84 43.83,41.26 44.62,41.26 44.62,41.26 46.03,41.26
MCU_UPSHIFTSIGN_IN: length 47.7
  Top Layer w0.178: 53.58,42.01 56.13,42.01 57.26,40.88 57.26,33.26 58.38,32.14 90.69,32.14 91.4,31.43 R194.1
MCU_UPSHIFTSIGN_OUT: length 31.2
  Top Layer w0.178: 46.03,42.26 46.02,42.25 v1(44.87,42.25) ; v2(25.63,52.66) 25.62,52.66 R201.2
  Inner1 w0.178: v1(44.87,42.25) 43.4,42.25 42.89,42.76 42.89,51.5 41.72,52.66 v2(25.63,52.66)
MOTOEN: length 65.1
  Top Layer w0.178: v2(17.23,5.83) 17.24,5.82 17.24,4.91
  Top Layer w0.254: SW5.3 4.7,19.06 4.7,11.45 5.4,10.75 17.39,10.75 18.71,9.43 18.71,6.39 18.15,5.83 v2(17.23,5.83)
  Inner1 w0.178: v2(17.23,5.83) 17.23,7.4 21.7,11.87 27.09,11.87 28.26,13.04 28.26,18.73 29.45,19.93 v1(42.38,19.93)
  Bottom Layer w0.178: v1(42.38,19.93) U50.13
PA8: length 47.6
  Top Layer w0.178: v1(52.37,37.01) 53.58,37.01
  Top Layer w0.254: v2(24.82,43.52) R184.2
  Inner2 w0.178: v2(24.82,43.52) 28.63,47.33 41.41,47.33 43.85,44.89 43.85,32.65 44.04,32.46 48.84,32.46 49.75,33.36 49.75,35.39 51.37,37.01 v1(52.37,37.01)
PA9: length 55.6
  Top Layer w0.178: v1(51.81,37.51) 53.58,37.51
  Bottom Layer w0.178: v1(51.81,37.51) 48.22,33.93 48.22,26.86 47.1,25.74 43.45,25.74 40.35,22.64 40.35,16.5 35.42,11.57 27.14,11.57 24.67,9.09 USART1.3
PA10: length 56.9
  Top Layer w0.178: v1(52.37,38.01) 53.58,38.01
  Bottom Layer w0.178: USART1.2 23.42,8.45 26.94,11.97 35.17,11.97 39.94,16.75 39.94,23.81 42.48,26.35 46.29,26.35 47.58,27.64 47.58,34.14 51.47,38.03 52.34,38.03 v1(52.37,38.01)
PB2: length 50.4
  Top Layer w0.178: v1(49.14,33.82) 49.08,33.76 46.03,33.76
  Inner2 w0.178: v1(49.14,33.82) 49.14,35.6 50.27,36.73 50.27,55.09 49.24,56.12 41.88,56.12 39.64,58.35 28.8,58.35 CN5.11
PB4: length 42.9
  Top Layer w0.178: 53.58,43.51 53.58,43.52 51.93,43.52 51.37,44.08 v1(51.37,45.04)
  Inner2 w0.178: v1(51.37,45.04) 51.37,46.1 52.35,47.08 52.35,61.24 51.09,62.5 33.14,62.5 CN5.10
PC4: length 56.6
  Top Layer w0.178: R211.1 91.4,22.9 90.74,23.56 88.35,23.56 87.09,24.82 87.09,29.8 85.51,31.38 51.52,31.38 50.31,32.6 50.31,35.7 49.24,36.76 46.03,36.76
PH-IN_1: length 6.5
  Top Layer w0.254: U48.2 29.6,42.53 28.62,43.52 R184.1 27.13,43.5 R191.2
PH_1: length 42.3
  Top Layer w0.254: U48.3 31.09,41.84 30.34,41.84 30.24,41.95 v2(29.99,41.95)
  Inner1 w0.178: v2(29.99,41.95) 29.53,41.95 29.22,41.64 29.22,39.36 29.53,39.05 39.28,39.05 40.09,38.24 40.09,36.36 42.63,33.82 42.63,26.5 43.52,25.62 45.75,25.62 47,24.37 47,21.63 46.24,20.86 42.44,20.86 v1(42.38,20.93)
  Bottom Layer w0.178: v1(42.38,20.93) U50.15
SERVOPWM_1: length 31.1
  Top Layer w0.178: v1(36.08,49.01) U46.11
  Bottom Layer w0.178: CN5.8 10.87,54.29 29.22,54.29 34.51,49.01 v1(36.08,49.01)
SERVOPWM_2: length 16.2
  Top Layer w0.178: CN5.9 34.81,60.17 34.81,54.54 33.99,53.72 33.99,47.64 34.58,47.06 U46.8
SH1_1: length 20.6
  Top Layer w0.178: v1(26.85,26.66) Q32.3
  Inner1 w0.178: v1(41.41,22.43) 28.57,22.43 27.7,23.3 27.7,25.81 v1(26.85,26.66)
  Bottom Layer w0.178: v1(41.41,22.43) U50.18
  vias: v1(1.63,29.66) v1(1.63,28.39) v1(1.63,27.12) v1(1.63,25.85) v1(1.63,24.58) v1(2.9,29.66) v1(2.9,28.39) v1(2.9,27.12) v1(2.9,23.31) v1(4.17,29.66) v1(4.17,28.39) v1(4.17,27.12) v1(4.17,25.85) v1(4.17,23.31) v1(5.44,29.66) v1(5.44,28.39) v1(5.44,27.12) v1(5.44,25.85) v1(5.44,24.58) v1(5.44,23.31) v1(6.71,29.66) v1(6.71,28.39) v1(6.71,27.12) v1(6.71,25.85) v1(6.71,24.58) v1(6.71,23.31) v1(7.98,29.66) v1(7.98,28.39) v1(7.98,27.12) v1(7.98,25.85) v1(7.98,24.58) v1(7.98,23.31) v1(9.25,29.66) v1(9.25,28.39) v1(9.25,27.12) v1(9.25,25.85) v1(10.52,29.66) v1(10.52,28.39) v1(10.52,27.12) v1(10.52,25.85) v1(11.79,29.66) v1(11.79,28.39) v1(11.79,27.12) v1(11.79,25.85) v1(11.79,24.58) v1(11.79,23.31) v1(13.06,29.66) v1(13.06,28.39) v1(13.06,27.12) v1(13.06,25.85) v1(13.06,24.58) v1(13.06,23.31) v1(14.33,29.66) v1(14.33,28.39) v1(14.33,27.12) v1(14.33,25.85) v1(14.33,24.58) v1(14.33,23.31) v1(15.6,29.66) v1(15.6,28.39) v1(15.6,27.12) v1(15.6,25.85) v1(15.6,24.58) v1(15.6,23.31) v1(16.87,29.66) v1(16.87,28.39) v1(16.87,27.12) v1(16.87,25.85) v1(16.87,24.58) v1(16.87,23.31) v1(18.14,29.66) v1(18.14,28.39) v1(18.14,27.12) v1(18.14,25.85) v1(18.14,24.58)
SH2_1: length 28.1
  Top Layer w0.178: v1(26.8,15.74) 25.79,15.74
  Inner1 w0.178: v1(45.88,24.34) 45.88,24.34 45.88,23.44 45.22,22.79 42.74,22.79 41.26,21.32 27.8,21.32 26.8,20.32 v1(26.8,15.74)
  Bottom Layer w0.178: v1(45.88,24.34) U50.23
  vias: v1(1.63,18.79) v1(1.63,17.52) v1(1.63,16.25) v1(1.63,14.98) v1(1.63,13.71) v1(2.9,16.25) v1(2.9,14.98) v1(2.9,13.71) v1(4.17,18.79) v1(4.17,17.52) v1(4.17,16.25) v1(4.17,14.98) v1(4.17,13.71) v1(5.44,21.33) v1(5.44,20.06) v1(5.44,18.79) v1(5.44,17.52) v1(5.44,16.25) v1(5.44,14.98) v1(5.44,13.71) v1(6.71,21.33) v1(6.71,20.06) v1(6.71,18.79) v1(6.71,17.52) v1(6.71,16.25) v1(6.71,14.98) v1(6.71,13.71) v1(7.98,21.33) v1(7.98,20.06) v1(7.98,18.79) v1(7.98,17.52) v1(7.98,16.25) v1(7.98,14.98) v1(7.98,13.71) v1(9.25,21.33) v1(9.25,17.52) v1(9.25,16.25) v1(9.25,14.98) v1(9.25,13.71) v1(10.52,21.33) v1(10.52,17.52) v1(10.52,16.25) v1(10.52,14.98) v1(10.52,13.71) v1(11.79,21.33) v1(11.79,20.06) v1(11.79,18.79) v1(11.79,17.52) v1(11.79,16.25) v1(11.79,14.98) v1(11.79,13.71) v1(13.06,21.33) v1(13.06,20.06) v1(13.06,18.79) v1(13.06,17.52) v1(13.06,16.25) v1(13.06,14.98) v1(13.06,13.71) v1(14.33,21.33) v1(14.33,20.06) v1(14.33,18.79) v1(14.33,17.52) v1(14.33,16.25) v1(14.33,14.98) v1(14.33,13.71) v1(15.6,21.33) v1(15.6,20.06) v1(15.6,18.79) v1(15.6,17.52) v1(15.6,16.25) v1(15.6,14.98) v1(15.6,13.71) v1(16.87,21.33) v1(16.87,20.06) v1(16.87,18.79) v1(16.87,17.52) v1(16.87,16.25) v1(16.87,14.98) v1(16.87,13.71) v1(18.14,18.79) v1(18.14,17.52) v1(18.14,16.25) v1(18.14,14.98) v1(18.14,13.71) v1(24.49,17.52) v1(24.49,16.25) v1(24.49,14.98)
SP_1: length 33.6
  Top Layer w0.178: v1(21.94,24.67) Q33.3
  Inner1 w0.178: v1(44.88,24.34) 44.78,24.34 44.7,24.42 43.6,24.42 42.84,23.66 29.58,23.66 29.01,24.23 29.01,26.62 27.75,27.87 24.5,27.87 21.94,25.32 v1(21.94,24.67)
  Bottom Layer w0.178: v1(44.88,24.34) U50.21
  Bottom Layer w0.254: 21.07,34.88 21.07,35.67 21.43,36.03 U51.2
  vias: v2(19.41,22.64) v2(19.47,21.12) v2(19.88,21.88) v2(20.64,21.07) v2(20.66,22.64) v2(21.3,21.88) v2(21.94,21.07) v2(21.96,22.64) v2(22.62,21.88) v2(23.18,22.58) v2(23.22,21.07)
SWITCH1_IN: length 118.4
  Top Layer w0.254: R200.2 R199.2 ; R199.2 92.08,37.15 v2(93.73,38.8) 95.39,38.8 SW12.1 ; R199.2 C161.1 89.58,33.61 D34.2
  Inner1 w0.178: CN5.20 22.72,66.08 25.92,66.08 26.94,65.06 26.94,63.28 27.8,62.42 36.49,62.42 40.81,58.1 56.2,58.1 64.38,66.28 89.88,66.28 93.65,62.51 93.65,38.87 v2(93.73,38.8)
SWITCH2_IN: length 127.5
  Top Layer w0.254: R212.2 R211.2 ; R211.2 91.77,20.62 v2(93.84,22.69) 95.87,22.69 SW13.1 ; R211.2 C162.1 89.58,17.05 D35.2
  Inner1 w0.178: v2(93.84,22.69) 93.18,23.35 93.18,62.16 89.73,65.62 64.68,65.62 56.55,57.49 40.5,57.49 35.99,62 27.56,62 25.3,64.26 CN5.19
UPSHIFTSIGN_IN: length 133.6
  Top Layer w0.254: R194.2 92.67,30.17 v1(92.67,31) 95.84,31 SW11.1 ; R194.2 R195.2 ; R194.2 C160.1 91.19,27.18 D32.2
  Inner1 w0.178: CN5.15 12.8,62.16 23.89,62.16 24.85,61.2 24.85,59.47 25.82,58.51 38.47,58.51 40.2,56.78 56.96,56.78 64.99,64.81 89.73,64.81 92.67,61.86 v1(92.67,31)
UPSHIFTSIGN_OUT: length 25.3
  Top Layer w0.178: 31.12,49.66 31.8,49.66 32.09,49.95 32.09,51.98 30.49,53.58 23.94,53.58 22.87,54.65 22.87,57.34 21.75,58.46 16.7,58.46 CN5.14
$2N634: length 1.6
  Top Layer w0.254: C83.1 58.91,22.07 R131.2
$2N635: length 2.4
  Top Layer w0.254: U27.6 60.42,19.78 R131.1
$2N636: length 3.4
  Top Layer w0.254: U27.1 56.6,14.31 56,14.92 C81.1
$2N639: length 3.7
  Top Layer w0.254: U27.5 62.85,19.67 R128.1 R129.2
$2N641: length 1.5
  Top Layer w0.254: LED6.2 23.36,3.87 R130.1
$2N642: length 2.2
  Top Layer w0.254: R128.2 63.49,20.56 R127.1
$2N644: length 2
  Top Layer w0.254: R126.2 63.34,14.31 U27.4
$2N909: length 16.6
  Top Layer w0.254: v2(78.25,3.64) 81.6,3.64 SW1.5 ; v2(74.69,12.3) Q11.4
  Inner1 w0.254: v2(78.25,3.64) 78.25,6.54 74.69,10.09 v2(74.69,12.3)
$2N910: length 10.9
  Top Layer w0.178: SW1.4 90.85,7.71 R132.2 91.86,6.69 D2.2
$2N1574: length 13.6
  Inner1 w0.508: v2(39.13,8.06) 39.12,8.07 v2(39.12,8.93) 38.66,8.47 36.44,8.47 34.37,10.54 v2(31.92,10.54) 31.92,10.53 v2(31.17,10.53)
  Bottom Layer w0.254: 40.96,5.61 41.21,5.87 41.21,8.26 40.96,8.52 40.32,8.52
$2N1704: length 1.5
  Top Layer w0.254: LED7.2 24.85,5.77 R135.1
$2N1742: length 2.2
  Bottom Layer w0.254: 42.36,5.61 43.02,6.27 43.02,7.57
$2N1819: length 3.7
  Bottom Layer w0.254: 42.37,11.31 42.37,10.64 42.02,10.3 42.02,8.88 42.38,8.52 43.02,8.52
$2N1977: length 3.2
  Bottom Layer w0.254: U32.4 45.96,9.47 R137.2
$3N7674: length 4.3
  Bottom Layer w0.178: U50.9 45.38,17.19 46.99,15.59
$3N7675: length 4
  Bottom Layer w0.178: 45.72,15.59 45.72,16.21 44.88,17.04 U50.10
$3N7678: length 9.9
  Bottom Layer w0.178: C151.1 52.02,22.62 C150.2 50.1,23.71 48.82,22.43 U50.1
  Bottom Layer w0.254: C150.2 50.91,23.72 50.91,24.98 51.57,25.64 53.16,25.64 D31.1
$3N7679: length 4.1
  Bottom Layer w0.178: C151.2 49.8,22.44 49.28,21.93 U50.2
$3N7680: length 5.3
  Bottom Layer w0.178: C152.1 51.42,21.78 50.2,21.78 49.85,21.43 U50.3
$3N7684: length 5.1
  Bottom Layer w0.178: U50.12 43.88,17.28 44.44,16.72 44.44,15.59 43.18,15.59
$3N7725: length 4
  Bottom Layer w0.178: U50.4 50.69,20.93 C152.2
$3N7729: length 1.7
  Top Layer w0.254: R182.1 12.07,3.28 LED8.2
$3N7730: length 2.3
  Top Layer w0.254: LED9.2 17.28,3.36 R183.1
$3N7744: length 6.8
  Top Layer w0.254: U48.12 38.15,41.88 39.78,43.52 40.95,43.52 R193.2
$3N7745: length 6.5
  Top Layer w0.254: R192.2 40.97,38.96 R206.1 39.49,38.94 38.5,39.93 U48.9
$3N7762: length 3.5
  Bottom Layer w0.254: C155.2 24.04,38.85 23.33,38.14 23.33,37.35 U51.4
$3N9430: length 6.5
  Top Layer w0.254: R179.2 27.13,51.28 R201.1 28.82,51.29 29.8,50.31 U46.2
$3N9436: length 6.8
  Top Layer w0.254: R178.2 27.13,46.74 R202.2 28.16,46.72 29.79,48.36 U46.5
$3N9438: length 6.8
  Top Layer w0.254: 36.97,49.66 38.41,49.66 40.04,51.29 R203.1 40.97,51.28 R181.2
$3N9440: length 6.5
  Top Layer w0.254: U46.9 38.45,47.71 39.43,46.72 R204.1 42.47,48.23 R180.2
$5N2602: length 2.9
  Bottom Layer w0.178: R209.1 86.02,53.02 H3.5
$5N2604: length 2.8
  Bottom Layer w0.178: H3.4 86.02,50.48 R210.1

## Copper pours and planes (outline as drawn; the poured copper is in the pictures)
GND_BAT on Top Layer: -1.05,54.19 18.15,54.19 23.13,49.21 23.13,44.99 23.94,44.18 30.77,44.18 32.57,45.98 42.15,45.98 43.49,44.64 43.49,25.79 44.26,25.03 86,25.03 87.85,23.18 87.85,16.79 89.17,15.48 101.36,15.48 101.46,15.38 101.46,-3.06 99.28,-5.25 2.55,-5.25 -1.05,-1.64
GND_BAT on Top Layer: -1.77,46.72 20.03,46.72 20.03,41.84 19.44,41.26 -1.77,41.26
GND_BAT on Bottom Layer: -1.05,54.19 18.15,54.19 23.13,49.21 23.13,44.99 23.94,44.18 30.77,44.18 32.57,45.98 42.15,45.98 43.49,44.64 43.49,25.79 44.26,25.03 86,25.03 87.85,23.18 87.85,16.79 89.17,15.48 101.36,15.48 101.46,15.38 101.46,-3.06 99.28,-5.25 2.55,-5.25 -1.05,-1.64
GND_BAT on Bottom Layer: -1.77,46.72 20.28,46.72 20.33,46.77 20.33,41.89 19.7,41.26 -1.77,41.26
GND_BAT on Inner1: -1.77,46.72 20.28,46.72 20.33,46.77 20.33,41.89 19.7,41.26 -1.77,41.26
GND_BAT on Inner1: -1.05,54.19 18.15,54.19 23.13,49.21 23.13,44.99 23.94,44.18 30.77,44.18 32.57,45.98 42.15,45.98 43.49,44.64 43.49,25.79 44.26,25.03 86,25.03 87.85,23.18 87.85,16.79 89.17,15.48 101.36,15.48 101.46,15.38 101.46,-3.06 99.28,-5.25 2.55,-5.25 -1.05,-1.64
GND_BAT on Inner2: -1.05,54.19 18.15,54.19 23.13,49.21 23.13,44.99 23.94,44.18 30.77,44.18 32.57,45.98 42.15,45.98 43.49,44.64 43.49,25.79 44.26,25.03 86,25.03 87.85,23.18 87.85,16.79 89.17,15.48 101.36,15.48 101.46,15.38 101.46,-3.06 99.28,-5.25 2.55,-5.25 -1.05,-1.64
GND_BAT on Inner2: -1.77,46.72 20.28,46.72 20.33,46.77 20.33,41.89 19.7,41.26 -1.77,41.26
GND_PRO on Top Layer: -2.58,54.04 18.5,54.04 23.18,49.36 23.18,45.35 24.45,44.08 30.67,44.08 32.57,45.97 41.86,45.97 43.5,44.33 43.5,25.54 44.06,24.98 85.92,24.98 87.69,23.2 87.69,16.8 89.12,15.38 102.58,15.38 102.83,15.63 102.83,67.9 98.51,72.22 -0.19,72.22 -2.58,69.83
GND_PRO on Bottom Layer: -2.88,53.93 18.2,53.93 22.87,49.26 22.87,45.25 24.14,43.98 30.37,43.98 32.26,45.87 41.55,45.87 43.19,44.23 43.19,25.44 43.75,24.88 85.61,24.88 87.39,23.1 87.39,16.7 88.81,15.28 102.27,15.28 102.53,15.53 102.53,67.8 98.21,72.12 -0.5,72.12 -2.88,69.73
